# EAGLE schematic schematic_servo_driver (EAGLE 9.3.0)
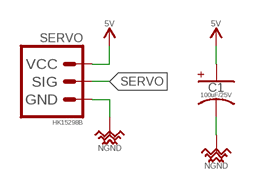
[diagram p0: schematic, sheet 1]

## Parts
C1  100uF/25V  100UF-POLARIZED_SMD_25V-20%_DIA5-LS2-H11  [_AE_PTH-DIA5-LS2-H11]
SERVO  HK15298B  SERVO_HK15298B_PTH_VERT_MALE_2.54MM  [HDRV3W64P254_1X3_762X254X838B]

## Nets
5V: C1.+(A) SERVO.VCC
NGND: C1.-(K) SERVO.GND
SERVO: SERVO.SIG

## Library data of the parts
C1 = _capacitors:100UF-POLARIZED; DATASHEET: http://nichicon-us.com/english/products/pdfs/e-uvy.pdf; DIST: Digikey; DISTLINK: https://www.digikey.com/products/en?keywords=UVY1E101MDD-ND; DISTPN: UVY1E101MDD-ND; MFR: Nichicon; MPN: UVY1E101MDD
SERVO = _motors:SERVO; DATASHEET: N/A; DATASHEET_CONNECTOR: P(G,R,A)xCxxSxxN Drawing, Straight; DIST: HobbyKing; DISTLINK: https://hobbyking.com/en_us/hobbykingtm-coreless-digital-hv-mg-bb-servo-20kg-0-16sec-66g.html?___store=en_us; DISTLINK_CONNECTOR: https://www.digikey.com/products/en?keywords=S1012E-03-ND; DISTPN: HK15298B; DISTPN_CONNECTOR: S1012E-03-ND; DIST_CONNECTOR: Digikey; MFR: HobbyKing; MFR_CONNECTOR: Sullins Connector Solutions; MPN: HK15298B; MPN_CONNECTOR: PEC03SAAN